# EasyEDA Pro project term_work.eprj

# Schematic Schematic1
Board Name: Board1; Create Date: 2024-12-19; Page Name: P1; Project Name: term_work; Schematic Name: Schematic1; Update Date: 2024-12-19; Company: 嘉立创EDA; Page Size: A4; Version: V1.0
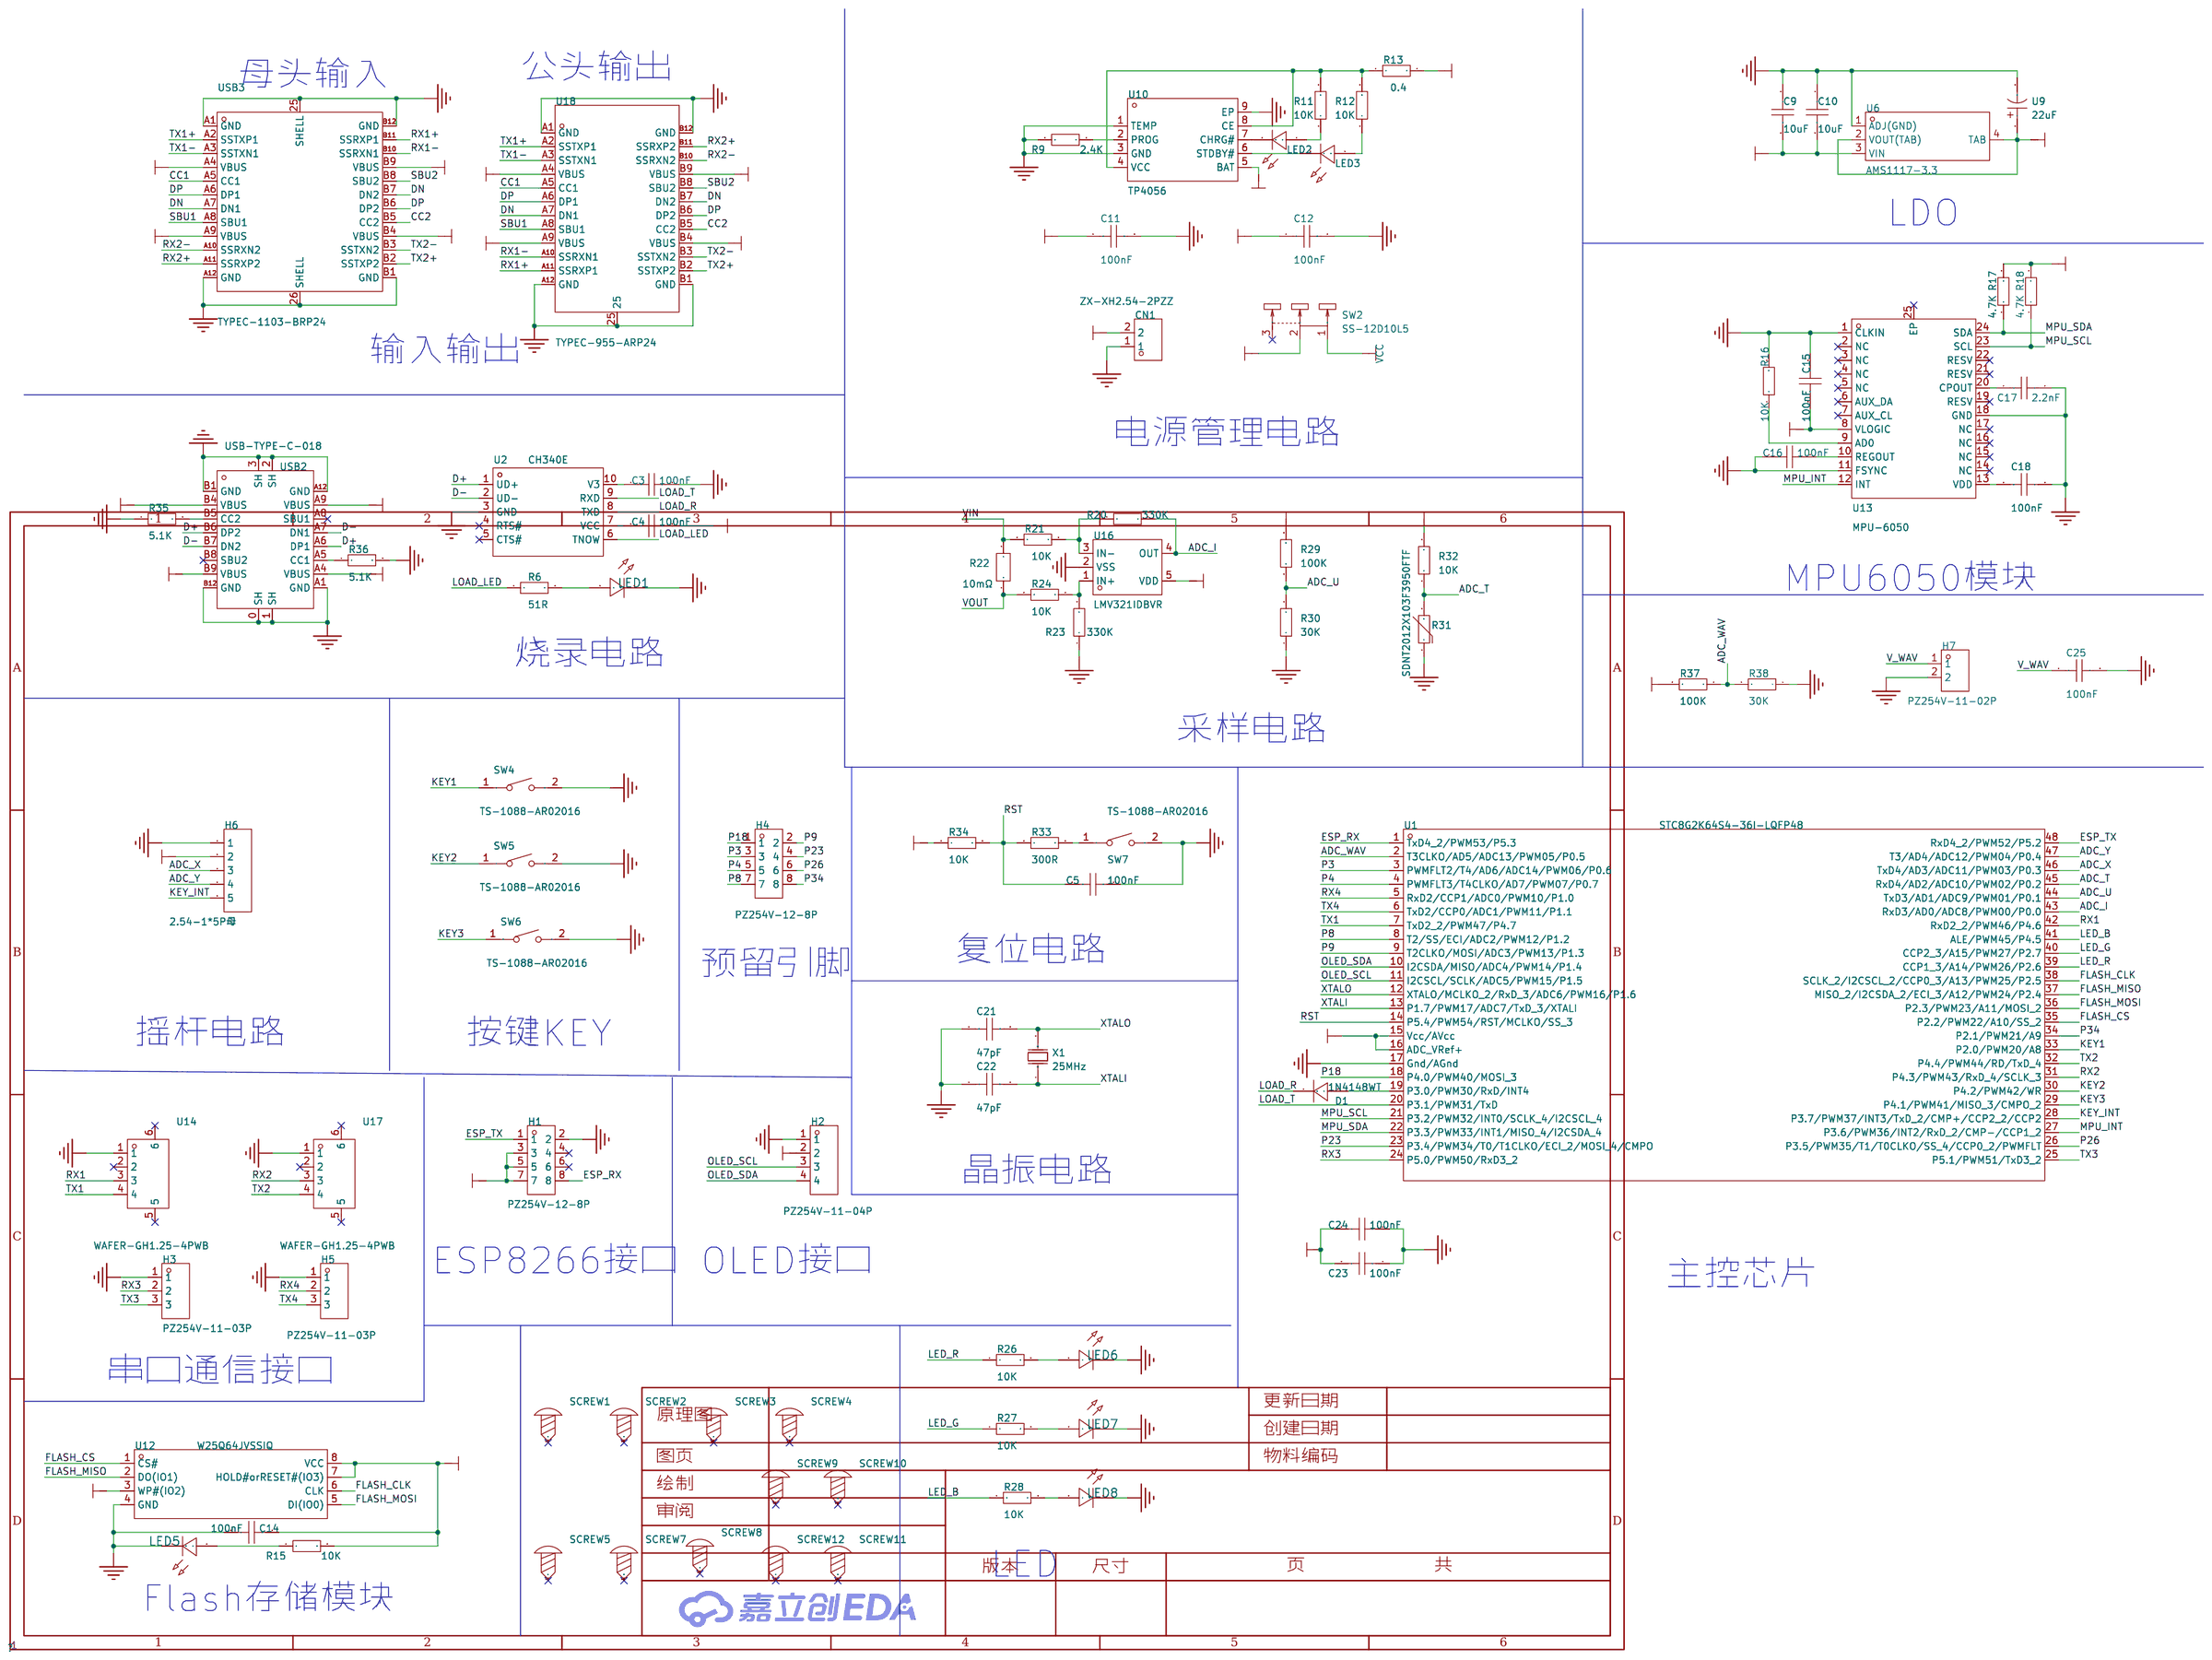
[diagram p0: schematic sheet]

## Parts
C3  100nF  [C0603]
C4  100nF  [C0603]
C5  100nF  [C0603]
C9  10uF  [C0603]
C10  10uF  [C0603]
C11  100nF  [C0603]
C12  100nF  [C0603]
C14  100nF  [C0603]
C15  100nF  [C0603]
C16  100nF  [C0603]
C17  2.2nF  [C0603]
C18  100nF  [C0603]
C21  47pF  [C0603]
C22  47pF  [C0603]
C23  100nF  [C0603]
C24  100nF  [C0603]
C25  100nF  [C0603]
CN1  ZX-XH2.54-2PZZ  [CONN-TH_2P-P2.50_HX25003-2A]
D1  1N4148WT  [SOD-523_L1.2-W0.8-LS1.6-RD]
H1  PZ254V-12-8P  [HDR-TH_8P-P2.54-V-M-R2-C4-S2.54]
H2  PZ254V-11-04P  [HDR-TH_4P-P2.54-V-M]
H3  PZ254V-11-03P  [HDR-TH_3P-P2.54-V-M]
H4  PZ254V-12-8P  [HDR-TH_8P-P2.54-V-M-R2-C4-S2.54]
H5  PZ254V-11-03P  [HDR-TH_3P-P2.54-V-M]
H6  2.54-1*5P母  [HDR-TH_5P-P2.54-V-F]
H7  PZ254V-11-02P  [HDR-TH_2P-P2.54-V-M]
LED1  -  [LED_0603]
LED2  -  [LED_TH-3mm]
LED3  -  [LED_TH-3mm]
LED5  -  [LED_0603]
LED6  -  [LED_0603]
LED7  -  [LED_0603]
LED8  -  [LED_0603]
R6  51R  [R0603]
R9  2.4K  [R0603]
R11  10K  [R0603]
R12  10K  [R0603]
R13  0.4  [R0603]
R15  10K  [R0603]
R16  10K  [R0603]
R17  4.7K  [R0603]
R18  4.7K  [R0603]
R20  330K  [R0603]
R21  10K  [R0603]
R22  10mΩ  [RES-SMD_L6.4-W3.2-1]
R23  330K  [R0603]
R24  10K  [R0603]
R26  10K  [R0603]
R27  10K  [R0603]
R28  10K  [R0603]
R29  100K  [R0603]
R30  30K  [R0603]
R31  SDNT2012X103F3950FTF  [R0805]
R32  10K  [R0603]
R33  300R  [R0603]
R34  10K  [R0603]
R35  5.1K  [R0603]
R36  5.1K  [R0603]
R37  100K  [R0603]
R38  30K  [R0603]
SCREW1  -  [M2螺丝]
SCREW2  -  [M2螺丝]
SCREW3  -  [M2螺丝]
SCREW4  -  [M2螺丝]
SCREW5  -  [M2螺丝]
SCREW7  -  [M2螺丝]
SCREW8  -  [M2螺丝]
SCREW9  -  [M3螺丝]
SCREW10  -  [M3螺丝]
SCREW11  -  [M3螺丝]
SCREW12  -  [M3螺丝]
SW2  SS-12D10L5  [SW-TH_SS-12D10L5]
SW4  TS-1088-AR02016  [SW-SMD_L3.9-W3.0-P4.45]
SW5  TS-1088-AR02016  [SW-SMD_L3.9-W3.0-P4.45]
SW6  TS-1088-AR02016  [SW-SMD_L3.9-W3.0-P4.45]
SW7  TS-1088-AR02016  [SW-SMD_L3.9-W3.0-P4.45]
U1  STC8G2K64S4-36I-LQFP48  [LQFP-48_L7.0-W7.0-P0.50-LS9.0-BL]
U2  CH340E  [MSOP-10_L3.0-W3.0-P0.50-LS5.0-BL]
U6  AMS1117-3.3  [SOT-223-4_L6.5-W3.5-P2.30-LS7.0-BR]
U9  22uF  [CAP-SMD_L2.0-W1.3-FD]
U10  TP4056  [ESOP-8_L4.9-W3.9-P1.27-LS6.0-BL-EP]
U12  W25Q64JVSSIQ  [SOIC-8_L5.3-W5.3-P1.27-LS8.0-BL]
U13  MPU-6050  [QFN-24_L4.0-W4.0-P0.50-BL-EP2.7]
U14  WAFER-GH1.25-4PWB  [CONN-SMD_4P-P1.25_XUNPU_WAFER-GH1.25-4PWB]
U16  LMV321IDBVR  [SOT-23-5_L2.9-W1.6-P0.95-LS2.8-BR]
U17  WAFER-GH1.25-4PWB  [CONN-SMD_4P-P1.25_XUNPU_WAFER-GH1.25-4PWB]
U18  TYPEC-955-ARP24  [TYPE-C-SMD_TYPEC-955-ARP24]
USB2  USB-TYPE-C-018  [USB-C_SMD-TYPE-C-31-M-12]
USB3  TYPEC-1103-BRP24  [USB-C-SMD_TYPEC-1103-BRP24]
X1  25MHz  [CRYSTAL-SMD_2P-L5.0-W3.2]

## Library data of the parts
C3-C5 C9-C12 C14-C18 C21-C25 = CAP_0603: Supplier Footprint: 0603
CN1 = ZX-XH2.54-2PZZ: 插针结构:1x2P;间距:2.54mm;安装方式:直插;参考系列:XH;总PIN数:2P;排数:1;每排PIN数:2;行距:-;额定电流:3A;触头材质:黄铜;触头镀层:锡;工作温度范围:-25℃~+85℃;; Supplier Part: C7429632; Manufacturer: Megastar(兆星); Supplier Footprint: 插件,P=2.54mm; JLCPCB Part Class: 扩展库; Datasheet: https://atta.szlcsc.com/upload/public/pdf/source/20230619/19BA6947230AA44A04D3EDD65E618FD0.pdf; Supplier: LCSC; Pins Structure: 1x2P; Pitch: 2.54mm; Mounting Style: 直插; Reference Series: XH; Number of Pins: 2P; Number of Rows: 1; Number of PINs Per Row: 2; Current Rating (Max): 3A; Contact Material: 黄铜; Contact Plating: 锡; Operating Temperature Range: -25℃~+85℃
D1 = 1N4148WT_C232841: 二极管配置:独立式;正向压降(Vf):1V@10mA;直流反向耐压(Vr):75V;平均整流电流(Io):300mA;功率:200mW;反向恢复时间(trr):4ns;; LCSC Part Name: 电压:75V 电流:300mA; Supplier Part: C232841; Manufacturer: onsemi(安森美); Supplier Footprint: SOD-523F; JLCPCB Part Class: 扩展库; Datasheet: https://atta.szlcsc.com/upload/public/pdf/source/20181222/C232841_42C5BA49E5A441BB8F6B91D0F4CD0D51.pdf; Supplier: LCSC; Diode Configuration: 独立式; Forward Voltage (Vf@If): 1V@10mA; Reverse Voltage (Vr): 75V; Average Rectified Current (Io): 300mA; Power Dissipation: 200mW; Reverse Leakage Current: 5uA@75V; Reverse Recovery Time (trr): 4ns; Operating Temperature: -55℃~+150℃@(Tj)
H1 H4 = PZ254V-12-8P: 插针结构:2x4P;间距:2.54mm;行距:2.54mm;圆针/方针:方针;安装类型:直插;排数:双排;总PIN位数:8P;额定电流:-;额定电压:-;配合针长度:6mm;塑高:2.5mm;端接针长度:3mm;触头材质:黄铜;触头镀层:-;工作温度范围:-40℃~+105℃;颜色:黑色;; LCSC Part Name: 间距:2.54mm 2x4P 直插 方针; Supplier Part: C492421; Manufacturer: XFCN(兴飞); Supplier Footprint: 插件,P=2.54mm; JLCPCB Part Class: 扩展库; Datasheet: https://atta.szlcsc.com/upload/public/pdf/source/20200309/C492421_DC8A206AF99CD7755BD4A5B0BC48200B.pdf; Supplier: LCSC; Pin Structure: 2x4P; Pitch: 2.54mm; Row Spacing: 2.54mm; Circluar Pins/Square Pins: 方针; Mounting Type: 直插; Number of Rows: 双排; Number of Pins: 8P; Length of Mating Pin: 6mm; Insulation Height: 2.5mm; Length of End Connection Pin: 3mm; Contact Material: 黄铜; Operating Temperature Range: -40℃~+105℃; Color: 黑色
H2 = PZ254V-11-04P: 插针结构:1x4P;间距:2.54mm;行距:-;圆针/方针:方针;安装类型:直插;排数:单排;总PIN位数:4P;额定电流:3A;额定电压:250V;配合针长度:6mm;塑高:2.5mm;端接针长度:3mm;触头材质:-;工作温度范围:-40℃~+105℃;颜色:黑色;; LCSC Part Name: 间距:2.54mm 1x4P 直插 方针; Supplier Part: C2691448; Manufacturer: XFCN(兴飞); Supplier Footprint: 插件,P=2.54mm; JLCPCB Part Class: 扩展库; Datasheet: https://atta.szlcsc.com/upload/public/pdf/source/20200309/C492403_F9F19131791D08044AD4F84F8E751A34.pdf; Supplier: LCSC; Pin Structure: 1x4P; Pitch: 2.54mm; Circluar Pins/Square Pins: 方针; Mounting Type: 直插; Number of Rows: 单排; Number of Pins: 4P; Current Rating (Max): 3A; Voltage Rating (Max): 250V; Length of Mating Pin: 6mm; Insulation Height: 2.5mm; Length of End Connection Pin: 3mm; Operating Temperature Range: -40℃~+105℃; Color: 黑色
H3 H5 = PZ254V-11-03P: 插针结构:1x3P;间距:2.54mm;行距:-;圆针/方针:方针;安装类型:直插;排数:单排;总PIN位数:3P;额定电流:3A;额定电压:250V;配合针长度:6mm;塑高:2.5mm;端接针长度:3mm;工作温度范围:-40℃~+105℃;颜色:黑色;; LCSC Part Name: 间距:2.54mm 1x3P 直插 方针; Supplier Part: C2937625; Manufacturer: XFCN(兴飞); Supplier Footprint: 插件,P=2.54mm; JLCPCB Part Class: 扩展库; Datasheet: https://atta.szlcsc.com/upload/public/pdf/source/20200309/C492402_8335C3D49C4E4C618838D59BB1D024C1.pdf; Supplier: LCSC; Pin Structure: 1x3P; Pitch: 2.54mm; Circluar Pins/Square Pins: 方针; Mounting Type: 直插; Number of Rows: 单排; Number of Pins: 3P; Current Rating (Max): 3A; Voltage Rating (Max): 250V; Length of Mating Pin: 6mm; Insulation Height: 2.5mm; Length of End Connection Pin: 3mm; Operating Temperature Range: -40℃~+105℃; Color: 黑色
H6 = 2.54-1*5P母: 插孔结构:1x5P;间距:2.54mm;行距:-;安装类型:直插;排数:单排;总孔位数:5P;塑高:-;触头材质:-;触头镀层:-;; LCSC Part Name: 间距:2.54mm 1x5P 直插; Supplier Part: C50950; Manufacturer: BOOMELE(博穆精密); Supplier Footprint: 插件,P=2.54mm; JLCPCB Part Class: 扩展库; Datasheet: https://atta.szlcsc.com/upload/public/pdf/source/20210301/C2718488_F4427B881E42CAA8DDB0B1C12B3A522C.pdf; Supplier: LCSC; Holes Structure: 1x5P; Pitch: 2.54mm; Mounting Type: 直插; Number of Rows: 单排; Number of Holes: 5P
H7 = PZ254V-11-02P: 插针结构:1x2P;间距:2.54mm;行距:-;圆针/方针:方针;安装类型:直插;排数:单排;总PIN位数:2P;额定电流:-;额定电压:-;配合针长度:6mm;塑高:2.5mm;端接针长度:3mm;触头材质:黄铜;触头镀层:-;工作温度范围:-40℃~+105℃;颜色:黑色;; LCSC Part Name: 间距:2.54mm 1x2P 直插 方针; Supplier Part: C492401; Manufacturer: XFCN(兴飞); Supplier Footprint: 插件,P=2.54mm; JLCPCB Part Class: 扩展库; Datasheet: https://atta.szlcsc.com/upload/public/pdf/source/20200309/C492401_A812433581A9B211A7FFA413ADDFF0E5.pdf; Supplier: LCSC; Pin Structure: 1x2P; Pitch: 2.54mm; Circluar Pins/Square Pins: 方针; Mounting Type: 直插; Number of Rows: 单排; Number of Pins: 2P; Length of Mating Pin: 6mm; Insulation Height: 2.5mm; Length of End Connection Pin: 3mm; Contact Material: 黄铜; Operating Temperature Range: -40℃~+105℃; Color: 黑色
LED1 LED5-LED8 = LED_0603-R: Supplier Footprint: 0603
LED2 LED3 = LED_TH-R_3mm: Supplier Footprint: 插件
R6 R9 R11-R13 R15-R18 R20 R21 R23 R24 R26-R30 R32-R38 = Res_0603: Supplier Footprint: 0603
R22 = HoJLR2512-3W-5mR-1%: 电阻类型:采样电阻;阻值:5mΩ;精度:±1%;功率:3W;安装方式:贴片;; LCSC Part Name: 5mΩ ±1% 3W; Supplier Part: C2903482; Manufacturer: Milliohm(毫欧); Supplier Footprint: 2512; JLCPCB Part Class: 扩展库; Datasheet: https://atta.szlcsc.com/upload/public/pdf/source/20211009/7525CABAB363C979E942C1DD41F1FEF0.pdf; Supplier: LCSC; Type: 采样电阻; Tolerance: ±1%; Power(Watts): 3W; Mounting Sytle: 贴片
R31 = SDNT2012X103F3950FTF: 阻值(25℃):10kΩ;B值(25℃/50℃):3950K;电阻精度:±1%;功率:200mW;B值精度:±1%;最大稳态电流(25℃):440uA;; LCSC Part Name: 10kΩ 电阻精度:±1% 3950K; Supplier Part: C95968; Manufacturer: Sunlord(顺络); Supplier Footprint: 0805; JLCPCB Part Class: 扩展库; Datasheet: https://atta.szlcsc.com/upload/public/pdf/source/20210916/BF106A3565EDFEB141CB3E0EA3A661F8.pdf; Supplier: LCSC; Resistance @ 25℃: 10kΩ; B Constant (25℃/50℃): 3950K; Resistance Tolerance: ±1%; Power: 200mW; B Constant Tolerance: ±1%; Steady State Current (Max): 440uA; Operating Temperature: -55℃~+125℃
SCREW1-SCREW5 SCREW7 SCREW8 = M2螺丝: Supplier Footprint: 插件
SCREW9-SCREW12 = M3螺丝: Supplier Footprint: 插件
SW2 = SS-12D10L5: 电路结构:单刀双掷;安装方式:直插;开关颜色:黑色;额定电流(DC):3A;额定电压(DC):125V;额定电流(AC):3A;额定电压(AC):125V;机械寿命:1万次;; LCSC Part Name: 柄长5mm 直插双档 滑动开关; Supplier Part: C319012; Manufacturer: XKB Connectivity(中国星坤); Supplier Footprint: 插件; JLCPCB Part Class: 扩展库; Datasheet: https://atta.szlcsc.com/upload/public/pdf/source/20211009/D6412F37AABE6F9459A6EE7FA4DAEADB.pdf; Supplier: LCSC; Circuit: 单刀双掷; Actuator Style: 矩形柱状; Pin Style: PC引脚; Switch Length: 13mm; Switch Width: 6.8mm; Switch Height: 6.4mm; Mounting Style: 直插; Actuator Color: 黑色; Current Rating (DC): 3A; Voltage Rating (DC): 125V; Current Rating (AC): 3A; Voltage Rating (AC): 125V; Mechanical Life: 1万次; Operating Temperature: -40℃~+85℃
SW4-SW7 = TS-1088-AR02016: 电路结构:单刀单掷;按钮形状:圆形按钮;作用力:160gf;安装方式:立贴;开关长度:4mm;开关宽度:3mm;开关高度:2mm;带支架:不带;触点电流:50mA;额定电压(DC):12V;绝缘电阻:100MΩ;机械寿命:10万次;; LCSC Part Name: 4*3*2mm 立贴 轻触开关; Supplier Part: C720477; Manufacturer: XUNPU(讯普); Supplier Footprint: SMD; JLCPCB Part Class: 扩展库; Datasheet: https://atta.szlcsc.com/upload/public/pdf/source/20200810/C720475_60D09DD6C54279ADDB2DC25100F1CC11.pdf; Supplier: LCSC; Circuit: 单刀单掷; Actuator Style: 圆形按钮; Operating Force: 160gf; Mounting Style: 立贴; Switch Length: 4mm; Switch Width: 3mm; Switch Height: 2mm; Strike Gundam: 不带; Contact Current: 50mA; Voltage Rating (DC): 12V; Insulation Resistance: 100MΩ; Actuator/Cap Color: 黑色; Pin Style: SMD接片; Mechanical Life: 10万次; Operating Temperature: -30℃~+80℃
U1 = STC8G2K64S4-36I-LQFP48: CPU内核:51系列;程序存储容量:64KB;RAM总容量:2.25KB;GPIO端口数量:45;工作电压范围:1.9V~5.5V;CPU最大主频:-;程序存储器类型:FLASH;; Supplier Part: C915668; Manufacturer: STC(宏晶); Supplier Footprint: LQFP-48(7x7); JLCPCB Part Class: 扩展库; Datasheet: https://atta.szlcsc.com/upload/public/pdf/source/20230914/7707908C45C6343AE73767C1466DDB8D.pdf; Supplier: LCSC; CPU Core: 51系列; Program Storage Size: 64KB; RAM Size: 2.25KB; GPIO Ports Number: 45; Operating Voltage Range: 1.9V~5.5V; Program Memory Type: FLASH; Operating Temperature Range: -40℃~+85℃; ADC (Bit): 10bit; PWM (Bit): 15bit; 16Bit Timer: 5; UART/USART: 4; I2C: 1; SPI: 1; Internal Comparator: 有; Peripheral/Function: 低电压检测；看门狗；CCP捕获/比较；除法器；乘法器; Watchdog: 有; Low-Voltage Detect: 有; CCP Capture/Compare: 有; Internal Oscillator: 有
U2 = CH340E: 应用功能:收发器;接口协议:USB 2.0;数据速率:2Mbps;; LCSC Part Name: USB转串口芯片 CH340; Supplier Part: C99652; Manufacturer: WCH(南京沁恒); Supplier Footprint: MSOP-10; JLCPCB Part Class: 扩展库; Datasheet: https://atta.szlcsc.com/upload/public/pdf/source/20230530/6E401E9554E9F5311886CC8B3F89B62E.pdf; Supplier: LCSC; Applications Function: 收发器; Protocol: USB 2.0; Supply Voltage: 3.3V；5V; Data Rate: 2Mbps
U6 = AMS1117-3.3_C347222: 输出类型:固定;最大输入电压:18V;输出电压:3.3V;输出电流:1A;电源纹波抑制比(PSRR):60dB@(120Hz);输出极性:正极;; LCSC Part Name: 输出:3.3V 电流:1A 耐压:12V; Supplier Part: C347222; Manufacturer: UMW(友台半导体); Supplier Footprint: SOT-223; JLCPCB Part Class: 扩展库; Datasheet: https://atta.szlcsc.com/upload/public/pdf/source/20231109/155D79A26D9DB04352555A58D5969DC8.pdf; Supplier: LCSC; Output Type: 固定; Maximum Input Voltage: 18V; Output Voltage: 3.3V; Output Current: 1A; Power Supply Rejection Ratio (PSRR): 60dB@(120Hz); Dropout Voltage: 1.3V@(1A); Feature: 过流保护(OCP); Output Polarity: 正极; Number of Outputs: 1
U9 = TMCP0J226MTRF: 容值:22uF;精度:±20%;额定电压:6.3V;等效串联电阻:5.9Ω@100kHz;; LCSC Part Name: 22uF ±20% 6.3V; Supplier Part: C4983891; Manufacturer: VISHAY(威世); Supplier Footprint: 0805; JLCPCB Part Class: 扩展库; Datasheet: https://atta.szlcsc.com/upload/public/pdf/source/20231213/45DEC9D623A3BCD604D80B89FE3D1B4C.pdf; Supplier: LCSC; Tolerance: ±20%; Rated Voltage: 6.3V; Equivalent Series Resistance(ESR): 5.9Ω@100kHz; Operating Temperature: -55℃~+125℃
U10 = TP4056_C725790: Supplier Part: C725790; Manufacturer: UMW(友台半导体); Supplier Footprint: ESOP-8; JLCPCB Part Class: Extended Part; Datasheet: https://atta.szlcsc.com/upload/public/pdf/source/20211011/37515E71BA298E23D23475482C49633D.pdf; Supplier: LCSC
U12 = W25Q64JVSSIQ: Supplier Part: C179171; Manufacturer: WINBOND(华邦); Supplier Footprint: SOIC-8-208mil; JLCPCB Part Class: 扩展库; Datasheet: https://atta.szlcsc.com/upload/public/pdf/source/20191218/C179171_92C5C91D0324539EDD8F1160D2E79C0F.pdf; Supplier: LCSC
U13 = MPU-6050: 传感器类型:加速度计陀螺仪;; Supplier Part: C24112; Manufacturer: TDK InvenSense(应美盛); Supplier Footprint: QFN-24-EP(4x4); JLCPCB Part Class: 扩展库; Datasheet: https://atta.szlcsc.com/upload/public/pdf/source/20140425/1457707046159.pdf; Supplier: LCSC; Sensor Type: 加速度计陀螺仪; Operating Temperature: -40℃~+85℃
U14 U17 = WAFER-GH1.25-4PWB: 插针结构:1x4P;间距:1.25mm;安装方式:卧贴;参考系列:GH;总PIN数:4P;排数:1;每排PIN数:4;额定电流:1A;工作温度范围:-25℃~+85℃;; LCSC Part Name: 1x4P 间距:1.25mm 卧贴 系列:GH; Supplier Part: C3029379; Manufacturer: XUNPU(讯普); Supplier Footprint: SMD,P=1.25mm,卧贴; JLCPCB Part Class: 扩展库; Datasheet: https://atta.szlcsc.com/upload/public/pdf/source/20220527/CB8773BFB0913C3B8ABD62CB38BA101A.pdf; Supplier: LCSC; Pins Structure: 1x4P; Pitch: 1.25mm; Mounting Style: 卧贴; Reference Series: GH; Number of Pins: 4P; Number of Rows: 1; Number of PINs Per Row: 4; Current Rating (Max): 1A; Operating Temperature Range: -25℃~+85℃
U16 = LMV321IDBVR_C3014306: 低功耗运放; Supplier Part: C3014306; Manufacturer: UMW(友台半导体); Supplier Footprint: SOT-23-5; JLCPCB Part Class: 扩展库; Datasheet: https://atta.szlcsc.com/upload/public/pdf/source/20231221/3CE86AED7262DC01AD69B40B1A503791.pdf; Supplier: LCSC
U18 = TYPEC-955-ARP24: 连接器类型:Type-C;标准:USB 3.1;公母:公;端口数量:1;触点数量:24P;安装方式:夹板;额定电流 - 电源:3A;触头材质:-;触头镀层:-;工作温度范围:-25℃~+85℃;焊接温度(最大值):260℃;; LCSC Part Name: Type-C 公 夹板; Supplier Part: C2895018; Manufacturer: XUNPU(讯普); Supplier Footprint: SMD; JLCPCB Part Class: 扩展库; Datasheet: https://atta.szlcsc.com/upload/public/pdf/source/20210908/4BE163E2B5C3395EA3793A403F88C638.pdf; Supplier: LCSC; Connector Type: Type-C; Standard: USB 3.1; Gender: 公; Number of Ports: 1; Number of Contacts: 24P; Mounting Style: 夹板; Current Rating - Power (Max): 3A; Operating Temperature Range: -25℃~+85℃; Soldering Temperature(Max): 260℃
USB2 = USB-TYPE-C-018: 连接器类型:Type-C;标准:-;公母:母;安装方式:卧贴;触点数量:16P;端口数量:1;额定电流 - 电源:3A;工作温度范围:-25℃~+85℃;; LCSC Part Name: Type-C 母 卧贴; Supplier Part: C2927038; Manufacturer: DEALON(德艺隆); Supplier Footprint: SMD; JLCPCB Part Class: 扩展库; Datasheet: https://atta.szlcsc.com/upload/public/pdf/source/20211217/CCD3D517E355E8E0CC52ABD8D5784AD8.pdf; Supplier: LCSC; Connector Type: Type-C; Gender: 母; Mounting Style: 卧贴; Number of Contacts: 16P; Number of Ports: 1; Current Rating - Power (Max): 3A; Operating Temperature Range: -25℃~+85℃
USB3 = TYPEC-1103-BRP24: 连接器类型:Type-C;标准:USB 3.1;公母:母;安装方式:夹板;触点数量:24P;端口数量:1;额定电流 - 电源:5A;工作温度范围:-30℃~+85℃;焊接温度(最大值):260℃;; LCSC Part Name: Type-C 母 夹板; Supplier Part: C2856665; Manufacturer: XUNPU(讯普); Supplier Footprint: SMD; JLCPCB Part Class: 扩展库; Datasheet: https://atta.szlcsc.com/upload/public/pdf/source/20220916/9C8CB477EC6775E046E4DED126C7C51B.pdf; Supplier: LCSC; Connector Type: Type-C; Standard: USB 3.1; Gender: 母; Mounting Style: 夹板; Number of Contacts: 24P; Number of Ports: 1; Current Rating - Power (Max): 5A; Operating Temperature Range: -30℃~+85℃; Soldering Temperature(Max): 260℃
X1 = XG1EL89CSI-111YLC-25M: 晶振类型:贴片晶振;频率:25MHz;常温频差:±10ppm;外接负载电容:20pF;频率稳定度(全温):±20ppm;; LCSC Part Name: 25MHz ±10ppm 20pF; Supplier Part: C7471626; Manufacturer: YXC(扬兴晶振); Supplier Footprint: SMD5032; JLCPCB Part Class: 扩展库; Datasheet: https://atta.szlcsc.com/upload/public/pdf/source/20240329/44922B0AF7B60E58E9B66993B6077277.pdf; Supplier: LCSC; Crystal Type: 贴片晶振; Normal temperature Frequency Tolerance: ±10ppm; External load capacitor: 20pF; Frequency Stability(Full temperature range): ±20ppm; Operating Temperature: -40℃~+85℃

## Nets
3V3: C14.2 C15.1 C23.2 C24.2 H1.3 H1.5 H1.7 H2.2 H6.2 R15.2 R17.2 R18.2 R32.2 R34.1 U1.15(Vcc/AVcc) U1.16(ADC_VRef+) U6.2(VOUT(TAB)) U6.4(TAB) U9.1 U12.3(WP#(IO2)) U12.7(HOLD#orRESET#(IO3)) U12.8(VCC) U13.8(VLOGIC) U16.5(VDD)
GND: C3.2 C5.1 C9.1 C10.1 C11.2 C12.2 C14.1 C15.2 C16.1 C17.2 C18.2 C21.1 C22.1 C23.1 C24.1 C25.2 CN1.1 H1.2 H2.1 H3.1 H5.1 H6.1 H7.2 LED1.1(C) LED5.1(C) LED6.1(C) LED7.1(C) LED8.1(C) R9.1 R16.2 R23.1 R30.1 R31.1 R35.1 R36.2 R38.1 SW4.2 SW5.2 SW6.2 SW7.2 U1.17(Gnd/AGnd) U2.3(GND) U6.1(ADJ(GND)) U9.2 U10.1(TEMP) U10.3(GND) U10.9(EP) U12.4(GND) U13.1(CLKIN) U13.11(FSYNC) U13.18(GND) U14.1 U16.2(VSS) U17.1 U18.25 U18.A1(GND) U18.A12(GND) U18.B1(GND) U18.B12(GND) USB2.0(SH) USB2.1(SH) USB2.2(SH) USB2.3(SH) USB2.A1(GND) USB2.A12(GND) USB2.B1(GND) USB2.B12(GND) USB3.25(SHELL) USB3.26(SHELL) USB3.A1(GND) USB3.A12(GND) USB3.B1(GND) USB3.B12(GND)
VBUS: C4.1 C11.1 R13.2 USB2.A4(VBUS) USB2.A9(VBUS) USB2.B4(VBUS) USB2.B9(VBUS)
VCC: C9.2 C10.2 SW2.1 U6.3(VIN)
VIN: R21.2 R22.2 R29.2 USB3.A4(VBUS) USB3.A9(VBUS) USB3.B4(VBUS) USB3.B9(VBUS)
ADC_I: R20.1 U1.43(RxD3/AD0/ADC8/PWM00/P0.0) U16.4(OUT)
ADC_T: R31.2 R32.1 U1.45(RxD4/AD2/ADC10/PWM02/P0.2)
ADC_U: R29.1 R30.2 U1.44(TxD3/AD1/ADC9/PWM01/P0.1)
ADC_WAV: R37.1 R38.2 U1.2(T3CLKO/AD5/ADC13/PWM05/P0.5)
ADC_X: H6.3 U1.46(TxD4/AD3/ADC11/PWM03/P0.3)
ADC_Y: H6.4 U1.47(T3/AD4/ADC12/PWM04/P0.4)
BAT: C12.1 CN1.2 SW2.2 U10.5(BAT)
CC1: U18.A5(CC1) USB3.A5(CC1)
CC2: U18.B5(CC2) USB3.B5(CC2)
D+: U2.1(UD+) USB2.A6(DP1) USB2.B6(DP2)
D-: U2.2(UD-) USB2.A7(DN1) USB2.B7(DN2)
DN: U18.A7(DN1) U18.B7(DN2) USB3.A7(DN1) USB3.B7(DN2)
DP: U18.A6(DP1) U18.B6(DP2) USB3.A6(DP1) USB3.B6(DP2)
ESP_RX: H1.8 U1.1(TxD4_2/PWM53/P5.3)
ESP_TX: H1.1 U1.48(RxD4_2/PWM52/P5.2)
FLASH_CLK: U1.38(SCLK_2/I2CSCL_2/CCP0_3/A13/PWM25/P2.5) U12.6(CLK)
FLASH_CS: U1.35(P2.2/PWM22/A10/SS_2) U12.1(CS#)
FLASH_MISO: U1.37(MISO_2/I2CSDA_2/ECI_3/A12/PWM24/P2.4) U12.2(DO(IO1))
FLASH_MOSI: U1.36(P2.3/PWM23/A11/MOSI_2) U12.5(DI(IO0))
KEY1: SW4.1 U1.33(P2.0/PWM20/A8)
KEY2: SW5.1 U1.30(P4.2/PWM42/WR)
KEY3: SW6.1 U1.29(P4.1/PWM41/MISO_3/CMPO_2)
KEY_INT: H6.5 U1.28(P3.7/PWM37/INT3/TxD_2/CMP+/CCP2_2/CCP2)
LED_B: R28.1 U1.41(ALE/PWM45/P4.5)
LED_G: R27.1 U1.40(CCP2_3/A15/PWM27/P2.7)
LED_R: R26.1 U1.39(CCP1_3/A14/PWM26/P2.6)
LOAD_LED: R6.1 U2.6(TNOW)
LOAD_R: D1.1(C) U2.8(TXD)
LOAD_T: U1.20(P3.1/PWM31/TxD) U2.9(RXD)
MPU_INT: U1.27(P3.6/PWM36/INT2/RxD_2/CMP-/CCP1_2) U13.12(INT)
MPU_SCL: R18.1 U1.21(P3.2/PWM32/INT0/SCLK_4/I2CSCL_4) U13.23(SCL)
MPU_SDA: R17.1 U1.22(P3.3/PWM33/INT1/MISO_4/I2CSDA_4) U13.24(SDA)
OLED_SCL: H2.3 U1.11(I2CSCL/SCLK/ADC5/PWM15/P1.5)
OLED_SDA: H2.4 U1.10(I2CSDA/MISO/ADC4/PWM14/P1.4)
P3: H4.3 U1.3(PWMFLT2/T4/AD6/ADC14/PWM06/P0.6)
P4: H4.5 U1.4(PWMFLT3/T4CLKO/AD7/PWM07/P0.7)
P8: H4.7 U1.8(T2/SS/ECI/ADC2/PWM12/P1.2)
P9: H4.2 U1.9(T2CLKO/MOSI/ADC3/PWM13/P1.3)
P18: H4.1 U1.18(P4.0/PWM40/MOSI_3)
P23: H4.4 U1.23(P3.4/PWM34/T0/T1CLKO/ECI_2/MOSI_4/CMPO)
P26: H4.6 U1.26(P3.5/PWM35/T1/T0CLKO/SS_4/CCP0_2/PWMFLT)
P34: H4.8 U1.34(P2.1/PWM21/A9)
RST: C5.2 R33.1 R34.2 U1.14(P5.4/PWM54/RST/MCLKO/SS_3)
RX1: U1.42(RxD2_2/PWM46/P4.6) U14.3
RX1+: U18.A11(SSRXP1) USB3.B11(SSRXP1)
RX1-: U18.A10(SSRXN1) USB3.B10(SSRXN1)
RX2: U1.31(P4.3/PWM43/RxD_4/SCLK_3) U17.3
RX2+: U18.B11(SSRXP2) USB3.A11(SSRXP2)
RX2-: U18.B10(SSRXN2) USB3.A10(SSRXN2)
RX3: H3.2 U1.24(P5.0/PWM50/RxD3_2)
RX4: H5.2 U1.5(RxD2/CCP1/ADC0/PWM10/P1.0)
SBU1: U18.A8(SBU1) USB3.A8(SBU1)
SBU2: U18.B8(SBU2) USB3.B8(SBU2)
TX1: U1.7(TxD2_2/PWM47/P4.7) U14.4
TX1+: U18.A2(SSTXP1) USB3.A2(SSTXP1)
TX1-: U18.A3(SSTXN1) USB3.A3(SSTXN1)
TX2: U1.32(P4.4/PWM44/RD/TxD_4) U17.4
TX2+: U18.B2(SSTXP2) USB3.B2(SSTXP2)
TX2-: U18.B3(SSTXN2) USB3.B3(SSTXN2)
TX3: H3.3 U1.25(P5.1/PWM51/TxD3_2)
TX4: H5.3 U1.6(TxD2/CCP0/ADC1/PWM11/P1.1)
V_WAV: C25.1 H7.1 R37.2
VOUT: R22.1 R24.2 U18.A4(VBUS) U18.A9(VBUS) U18.B4(VBUS) U18.B9(VBUS)
XTALI: C22.2 U1.13(P1.7/PWM17/ADC7/TxD_3/XTALI) X1.1(OSC1)
XTALO: C21.2 U1.12(XTALO/MCLKO_2/RxD_3/ADC6/PWM16/P1.6) X1.2(OSC2)
$1N8906: C3.1 U2.10(V3)
$1N8907: C4.2 U2.7(VCC)
$1N8911: LED1.2(A) R6.2
$1N8927: R36.1 USB2.A5(CC1)
$1N8929: R35.2 USB2.B5(CC2)
$1N8941: LED3.2(A) U10.6(STDBY#)
$1N8942: LED2.2(A) U10.7(CHRG#)
$1N8943: LED3.1(C) R12.1
$1N8944: R9.2 U10.2(PROG)
$1N8946: R11.2 R12.2 R13.1 U10.4(VCC) U10.8(CE)
$1N8947: LED2.1(C) R11.1
$1N8963: LED5.2(A) R15.1
$1N8976: R16.1 U13.9(AD0)
$1N8980: C16.2 U13.10(REGOUT)
$1N8986: C17.1 U13.20(CPOUT)
$1N8988: C18.1 U13.13(VDD)
$1N8997: R20.2 R21.1 U16.3(IN-)
$1N9001: R23.2 R24.1 U16.1(IN+)
$1N9015: LED6.2(A) R26.2
$1N9019: LED7.2(A) R27.2
$1N9023: LED8.2(A) R28.2
$1N9160: D1.2(A) U1.19(P3.0/PWM30/RxD/INT4)
$1N9164: R33.2 SW7.1

Not connected (* = marked no-connect by the designer): H1 4* 6*; SCREW1 1*; SCREW2 1*; SCREW3 1*; SCREW4 1*; SCREW5 1*; SCREW7 1*; SCREW8 1*; SCREW9 1*; SCREW10 1*; SCREW11 1*; SCREW12 1*; SW2 3*; U2 4(RTS#)* 5(CTS#)*; U13 2(NC)* 3(NC)* 4(NC)* 5(NC)* 6(AUX_DA)* 7(AUX_CL)* 14(NC)* 15(NC)* 16(NC)* 17(NC)* 19(RESV)* 21(RESV)* 22(RESV)* 25(EP)*; U14 2* 5* 6*; U17 2* 5* 6*; USB2 A8(SBU1)* B8(SBU2)*

## Notes on the sheet
- 母头输入
- 公头输出
- LDO
- 输入输出
- 电源管理电路
- MPU6050模块
- 烧录电路
- 采样电路
- 复位电路
- 预留引脚
- 摇杆电路
- 按键KEY
- 晶振电路
- ESP8266接口
- OLED接口
- 主控芯片
- 串口通信接口
- LED
- Flash存储模块

# Board PCB1
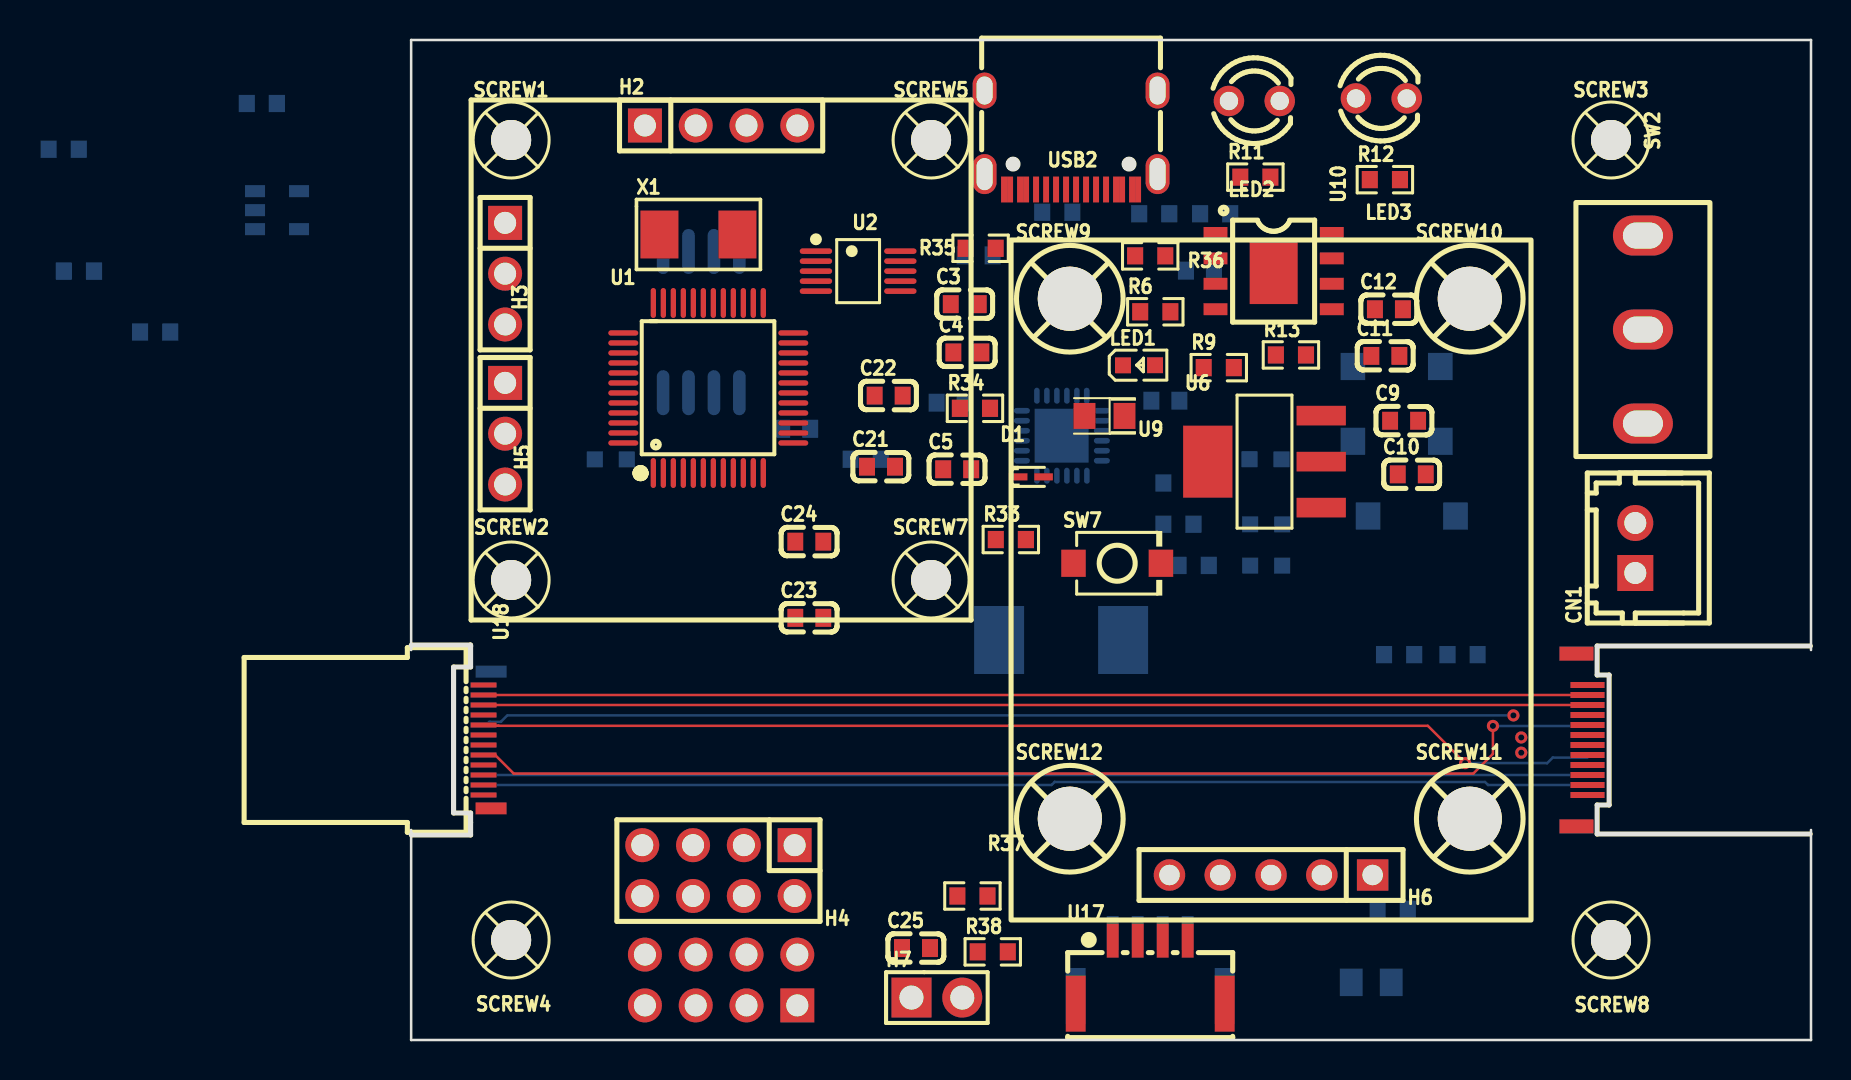
[diagram p1: board, top side]
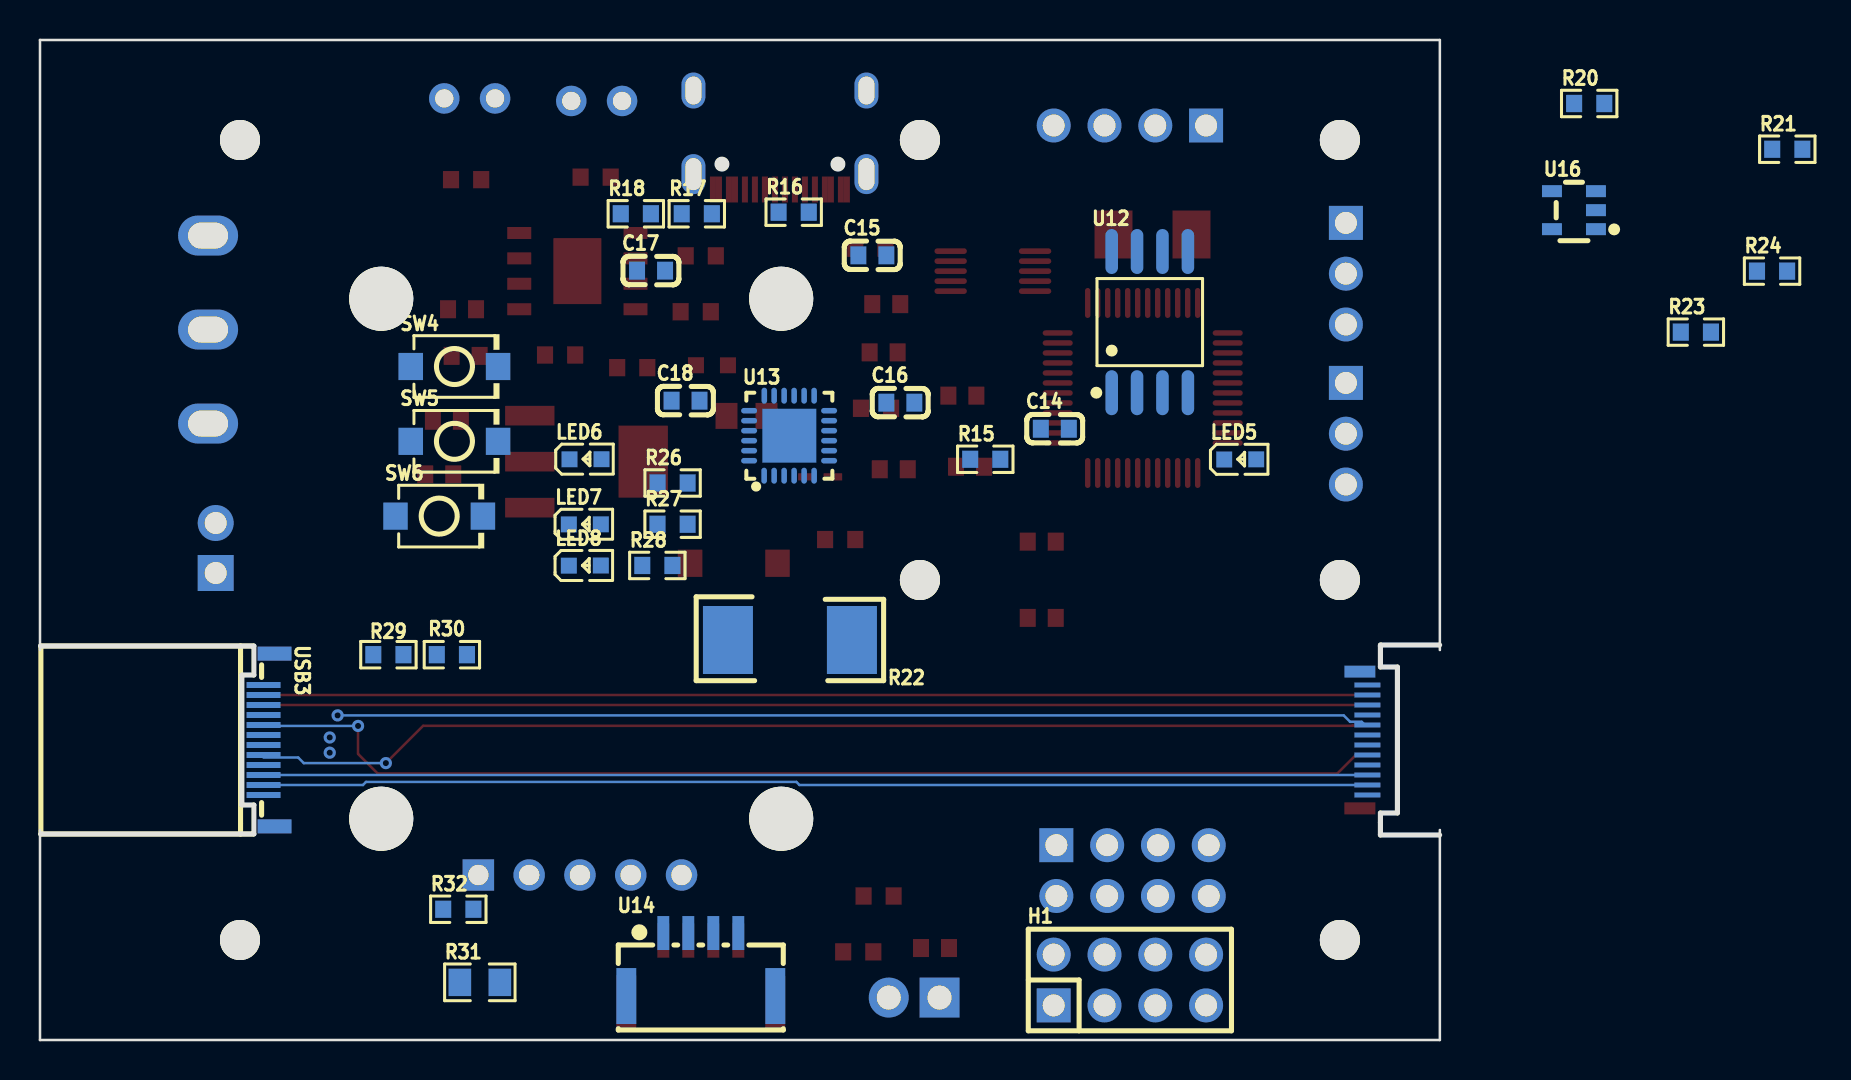
[diagram p2: board, bottom side, seen from below]

Outline 70 x 50 mm; copper layers: Top Layer, Bottom Layer. Coordinates in mm from the lower left corner of the outline.
Outline path: 0,19.5 0,50 70,50 70,19.5 ; 0,10.5 0,0 70,0 70,10.5
Stack: Top Layer 0.035mm / Dielectric1 1.51mm FR4 er 4.5 / Bottom Layer 0.035mm

## Design rules (mm)
template: JLCPCB Capability(Two Layers Board)
spacing copperThickness1oz (default): track to track 0.102, other pairs 0.152 to 0.3
spacing copperThickness2oz: track to track 0.203, other pairs 0.152 to 0.3
track width copperThickness1oz (default): min 0.127, default 0.254, max 2.54
track width copperThickness2oz: min 0.203, default 0.254, max 2.54
differential pair differentialPair (default): width min 0.127, default 0.254, max 2.54; gap min 0.152, default 0.152
via viaSize (default): diameter min 0.5, default 0.61, max 10; hole min 0.3, default 0.305, max 6.3

## Placement (name value [footprint] x y rotation side)
C3  100nF  [C0603]  27.69 36.79 0 top
C4  100nF  [C0603]  27.81 34.38 0 top
C5  100nF  [C0603]  27.31 28.54 0 top
C9  10uF  [C0603]  49.65 30.96 0 top
C10  10uF  [C0603]  50.04 28.28 0 top
C11  100nF  [C0603]  48.72 34.21 0 top
C12  100nF  [C0603]  48.9 36.54 0 top
C14  100nF  [C0603]  19.25 30.56 180 bottom
C15  100nF  [C0603]  28.37 39.23 180 bottom
C16  100nF  [C0603]  26.98 31.87 180 bottom
C17  2.2nF  [C0603]  39.44 38.47 180 bottom
C18  100nF  [C0603]  37.72 31.97 180 bottom
C21  47pF  [C0603]  23.5 28.66 0 top
C22  47pF  [C0603]  23.88 32.22 0 top
C23  100nF  [C0603]  19.91 21.11 0 top
C24  100nF  [C0603]  19.91 24.92 0 top
C25  100nF  [C0603]  25.25 4.6 0 top
CN1  ZX-XH2.54-2PZZ  [CONN-TH_2P-P2.50_HX25003-2A]  61.21 24.6 90 top
D1  1N4148WT  [SOD-523_L1.2-W0.8-LS1.6-RD]  30.99 28.16 0 top
H1  PZ254V-12-8P  [HDR-TH_8P-P2.54-V-M-R2-C4-S2.54]  15.5 3 180 bottom
H2  PZ254V-11-04P  [HDR-TH_4P-P2.54-V-M]  15.5 45.72 0 top
H3  PZ254V-11-03P  [HDR-TH_3P-P2.54-V-M]  4.7 38.32 270 top
H4  PZ254V-12-8P  [HDR-TH_8P-P2.54-V-M-R2-C4-S2.54]  15.37 8.47 180 top
H5  PZ254V-11-03P  [HDR-TH_3P-P2.54-V-M]  4.7 30.31 270 top
H6  2.54-1*5P母  [HDR-TH_5P-P2.54-V-F]  43 8.25 180 top
H7  PZ254V-11-02P  [HDR-TH_2P-P2.54-V-M]  26.29 2.12 0 top
LED1  -  [LED_0603]  36.45 33.74 0 top
LED2  -  [LED_TH-3mm]  42.16 46.95 0 top
LED3  -  [LED_TH-3mm]  48.51 47.08 0 top
LED5  -  [LED_0603]  9.93 29.04 180 bottom
LED6  -  [LED_0603]  42.67 29.05 180 bottom
LED7  -  [LED_0603]  42.71 25.79 180 bottom
LED8  -  [LED_0603]  42.71 23.73 180 bottom
R6  51R  [R0603]  37.21 36.41 0 top
R9  2.4K  [R0603]  40.39 33.62 0 top
R11  10K  [R0603]  42.22 43.14 0 top
R12  10K  [R0603]  48.69 43.02 0 top
R13  0.4  [R0603]  43.99 34.25 0 top
R15  10K  [R0603]  22.73 29.04 180 bottom
R16  10K  [R0603]  32.31 41.39 180 bottom
R17  4.7K  [R0603]  37.16 41.31 180 bottom
R18  4.7K  [R0603]  40.21 41.31 180 bottom
R20  330K  [R0603]  -7.47 46.83 180 bottom
R21  10K  [R0603]  -17.37 44.54 180 bottom
R22  10mΩ  [RES-SMD_L6.4-W3.2-1]  32.5 20 0 bottom
R23  330K  [R0603]  -12.8 35.39 180 bottom
R24  10K  [R0603]  -16.61 38.44 180 bottom
R26  10K  [R0603]  38.37 27.85 180 bottom
R27  10K  [R0603]  38.37 25.79 180 bottom
R28  10K  [R0603]  39.13 23.73 180 bottom
R29  100K  [R0603]  52.58 19.27 0 bottom
R30  30K  [R0603]  49.4 19.27 0 bottom
R31  SDNT2012X103F3950FTF  [R0805]  48.01 2.88 180 bottom
R32  10K  [R0603]  49.08 6.54 180 bottom
R33  300R  [R0603]  29.99 25.02 0 top
R34  10K  [R0603]  28.19 31.58 0 top
R35  5.1K  [R0603]  28.48 39.59 0 top
R36  5.1K  [R0603]  36.96 39.2 0 top
R37  100K  [R0603]  28.07 7.2 180 top
R38  30K  [R0603]  29.08 4.41 0 top
SCREW1  -  [M2螺丝]  5 45 0 top
SCREW2  -  [M2螺丝]  5 23 0 top
SCREW3  -  [M2螺丝]  60 45 0 top
SCREW4  -  [M2螺丝]  5 5 0 top
SCREW5  -  [M2螺丝]  26 45 0 top
SCREW7  -  [M2螺丝]  26 23 0 top
SCREW8  -  [M2螺丝]  60 5 0 top
SCREW9  -  [M3螺丝]  33 37 0 top
SCREW10  -  [M3螺丝]  53 37 0 top
SCREW11  -  [M3螺丝]  53 11 0 top
SCREW12  -  [M3螺丝]  33 11 0 top
SW2  SS-12D10L5  [SW-TH_SS-12D10L5]  61.59 35.52 270 top
SW4  TS-1088-AR02016  [SW-SMD_L3.9-W3.0-P4.45]  49.28 33.67 180 bottom
SW5  TS-1088-AR02016  [SW-SMD_L3.9-W3.0-P4.45]  49.28 29.93 180 bottom
SW6  TS-1088-AR02016  [SW-SMD_L3.9-W3.0-P4.45]  50.04 26.19 180 bottom
SW7  TS-1088-AR02016  [SW-SMD_L3.9-W3.0-P4.45]  35.31 23.84 0 top
U1  STC8G2K64S4-36I-LQFP48  [LQFP-48_L7.0-W7.0-P0.50-LS9.0-BL]  14.86 32.6 0 top
U2  CH340E  [MSOP-10_L3.0-W3.0-P0.50-LS5.0-BL]  22.35 38.44 270 top
U6  AMS1117-3.3  [SOT-223-4_L6.5-W3.5-P2.30-LS7.0-BR]  42.67 28.92 0 top
U9  22uF  [CAP-SMD_L2.0-W1.3-FD]  34.67 31.2 180 top
U10  TP4056  [ESOP-8_L4.9-W3.9-P1.27-LS6.0-BL-EP]  43.13 38.44 270 top
U12  W25Q64JVSSIQ  [SOIC-8_L5.3-W5.3-P1.27-LS8.0-BL]  14.51 35.89 180 bottom
U13  MPU-6050  [QFN-24_L4.0-W4.0-P0.50-BL-EP2.7]  32.54 30.21 180 bottom
U14  WAFER-GH1.25-4PWB  [CONN-SMD_4P-P1.25_XUNPU_WAFER-GH1.25-4PWB]  36.96 3.77 180 bottom
U16  LMV321IDBVR  [SOT-23-5_L2.9-W1.6-P0.95-LS2.8-BR]  -6.71 41.49 180 bottom
U17  WAFER-GH1.25-4PWB  [CONN-SMD_4P-P1.25_XUNPU_WAFER-GH1.25-4PWB]  36.96 3.39 0 top
U18  TYPEC-955-ARP24  [TYPE-C-SMD_TYPEC-955-ARP24]  3.81 15 270 top
USB2  USB-TYPE-C-018  [USB-C_SMD-TYPE-C-31-M-12]  33 45 180 top
USB3  TYPEC-1103-BRP24  [USB-C-SMD_TYPEC-1103-BRP24]  58.55 15 270 bottom
X1  25MHz  [CRYSTAL-SMD_2P-L5.0-W3.2]  14.37 40.28 0 top

## Footprints (pads in the part's own frame, mm; a bottom-side part is the same pattern mirrored in y, then rotated)
C0603
  rect 0.8x0.9 smd: 1(-0.7,0) 2(0.7,0)
CAP-SMD_L2.0-W1.3-FD
  rect 1.1x1.3 smd: 1(-1,0) 2(1,0)
CONN-SMD_4P-P1.25_XUNPU_WAFER-GH1.25-4PWB
  rect 0.6x1.7 smd: 1(-1.875,1.575) 2(-0.625,1.575) 3(0.625,1.575) 4(1.875,1.575)
  rect 1x2.8 smd: 5(3.725,-1.575) 6(-3.725,-1.575)
CONN-TH_2P-P2.50_HX25003-2A
  rect 1.8x1.8 hole 1.1: 1(-1.25,0)
  round 1.8 hole 1.1: 2(1.25,0)
CRYSTAL-SMD_2P-L5.0-W3.2
  rect 1.9x2.4 smd: 1(-1.95,0) 2(1.95,0)
ESOP-8_L4.9-W3.9-P1.27-LS6.0-BL-EP
  rect 0.6x1.2 smd: 1(-1.905,-2.909) 2(-0.635,-2.909) 3(0.635,-2.909) 4(1.905,-2.909) 5(1.905,2.909) 6(0.635,2.909) 7(-0.635,2.909) 8(-1.905,2.909)
  rect 3.3x2.4 smd: 9(0,0)
HDR-TH_2P-P2.54-V-M
  rect 2x2 hole 1.2: 1(-1.27,0)
  round 2 hole 1.2: 2(1.27,0)
HDR-TH_3P-P2.54-V-M
  rect 1.7x1.7 hole 1.1: 1(-2.54,0)
  round 1.7 hole 1.1: 2(0,0) 3(2.54,0)
HDR-TH_4P-P2.54-V-M
  rect 1.7x1.7 hole 1.1: 1(-3.81,0)
  round 1.7 hole 1.1: 2(-1.27,0) 3(1.27,0) 4(3.81,0)
HDR-TH_5P-P2.54-V-F
  rect 1.575x1.575 hole 1.02: 1(-5.08,0)
  round 1.575 hole 1.02: 2(-2.54,0) 3(0,0) 4(2.54,0) 5(5.08,0)
HDR-TH_8P-P2.54-V-M-R2-C4-S2.54
  rect 1.7x1.7 hole 1.1: 1(-3.81,-1.27)
  round 1.7 hole 1.1: 2(-3.81,1.27) 3(-1.27,-1.27) 4(-1.27,1.27) 5(1.27,-1.27) 6(1.27,1.27) 7(3.81,-1.27) 8(3.81,1.27)
LED_0603
  rect 0.8x0.8 smd: 1(-0.851,-0.01) 2(0.75,-0.005)
LED_TH-3mm
  round 1.524 hole 0.914: 1(-1.27,0) 2(1.27,0)
LQFP-48_L7.0-W7.0-P0.50-LS9.0-BL
  oval 0.27x1.5 smd: 1(-2.75,-4.25) 2(-2.25,-4.25) 3(-1.75,-4.25) 4(-1.25,-4.25) 5(-0.75,-4.25) 6(-0.25,-4.25) 7(0.25,-4.25) 8(0.75,-4.25) 9(1.25,-4.25) 10(1.75,-4.25) 11(2.25,-4.25) 12(2.75,-4.25) 25(2.75,4.25) 26(2.25,4.25) 27(1.75,4.25) 28(1.25,4.25) 29(0.75,4.25) 30(0.25,4.25) 31(-0.25,4.25) 32(-0.75,4.25) 33(-1.25,4.25) 34(-1.75,4.25) 35(-2.25,4.25) 36(-2.75,4.25)
  oval 1.5x0.27 smd: 13(4.25,-2.75) 14(4.25,-2.25) 15(4.25,-1.75) 16(4.25,-1.25) 17(4.25,-0.75) 18(4.25,-0.25) 19(4.25,0.25) 20(4.25,0.75) 21(4.25,1.25) 22(4.25,1.75) 23(4.25,2.25) 24(4.25,2.75) 37(-4.25,2.75) 38(-4.25,2.25) 39(-4.25,1.75) 40(-4.25,1.25) 41(-4.25,0.75) 42(-4.25,0.25) 43(-4.25,-0.25) 44(-4.25,-0.75) 45(-4.25,-1.25) 46(-4.25,-1.75) 47(-4.25,-2.25) 48(-4.25,-2.75)
M2螺丝
  round 2 hole 2: 1(0,0)
M3螺丝
  round 3.2 hole 3.2: 1(-0.064,0.064)
MSOP-10_L3.0-W3.0-P0.50-LS5.0-BL
  oval 0.28x1.62 smd: 1(-1,-2.11) 2(-0.5,-2.11) 3(0,-2.11) 4(0.5,-2.11) 5(1,-2.11) 6(1,2.11) 7(0.5,2.11) 8(0,2.11) 9(-0.5,2.11) 10(-1,2.11)
QFN-24_L4.0-W4.0-P0.50-BL-EP2.7
  oval 0.28x0.8 smd: 1(-1.25,-2) 2(-0.75,-2) 3(-0.25,-2) 4(0.25,-2) 5(0.75,-2) 6(1.25,-2) 13(1.25,2) 14(0.75,2) 15(0.25,2) 16(-0.25,2) 17(-0.75,2) 18(-1.242,2)
  oval 0.8x0.28 smd: 7(2,-1.25) 8(2,-0.75) 9(2,-0.25) 10(2,0.25) 11(2,0.75) 12(2,1.25) 19(-2,1.25) 20(-2,0.75) 21(-2,0.25) 22(-2,-0.25) 23(-2,-0.75) 24(-2,-1.25)
  rect 2.7x2.7 smd: 25(0.013,0)
R0603
  rect 0.806x0.864 smd: 1(-0.753,0) 2(0.753,0)
R0805
  rect 1.133x1.377 smd: 1(-1,0) 2(1,0)
RES-SMD_L6.4-W3.2-1
  rect 2.5x3.4 smd: 1(-3.1,0) 2(3.1,0)
SOD-523_L1.2-W0.8-LS1.6-RD
  rect 0.93x0.36 smd: 1(-0.635,0) 2(0.635,0)
SOIC-8_L5.3-W5.3-P1.27-LS8.0-BL
  oval 0.63x2.25 smd: 1(-1.905,-3.53) 2(-0.635,-3.53) 3(0.635,-3.53) 4(1.905,-3.53) 5(1.905,3.53) 6(0.635,3.53) 7(-0.635,3.53) 8(-1.905,3.53)
SOT-23-5_L2.9-W1.6-P0.95-LS2.8-BR
  rect 1x0.6 smd: 1(1.1,-0.95) 2(1.1,0) 3(1.1,0.95) 4(-1.1,0.95) 5(-1.1,-0.95)
SOT-223-4_L6.5-W3.5-P2.30-LS7.0-BR
  rect 2.47x0.98 smd: 1(2.835,-2.3) 2(2.835,0) 3(2.835,2.3)
  rect 2.47x3.6 smd: 4(-2.835,0)
SW-SMD_L3.9-W3.0-P4.45
  rect 1.23x1.36 smd: 1(-2.185,0) 2(2.185,0)
SW-TH_SS-12D10L5
  oval 2x3 hole 1.3x2: 1(-4.7,0) 2(0,0) 3(4.7,0)
TYPE-C-SMD_TYPEC-955-ARP24
  rect 0.6x1.55 smd far side: 25(-3.42,0.188)
  rect 0.6x1.55 smd: 25(3.42,0.188)
  rect 0.25x1.3 smd: A1(2.75,-0.188) A2(2.25,-0.188) A3(1.75,-0.188) A4(1.25,-0.188) A5(0.75,-0.188) A6(0.25,-0.188) A7(-0.25,-0.188) A8(-0.75,-0.188) A9(-1.25,-0.188) A10(-1.75,-0.188) A11(-2.25,-0.188) A12(-2.75,-0.188)
  rect 0.25x1.3 smd far side: B1(-2.75,-0.188) B2(-2.25,-0.188) B3(-1.75,-0.188) B4(-1.25,-0.188) B5(-0.75,-0.188) B6(-0.25,-0.188) B7(0.25,-0.188) B8(0.75,-0.188) B9(1.25,-0.188) B10(1.75,-0.188) B11(2.25,-0.188) B12(2.75,-0.188)
USB-C-SMD_TYPEC-1103-BRP24
  rect 0.7x1.7 smd: 25(-4.32,0.275) 25(4.32,0.275)
  rect 0.7x1.7 smd far side: 26(-4.32,0.275) 26(4.32,0.275)
  rect 0.3x1.7 smd: A1(-2.75,-0.275) A2(-2.25,-0.275) A3(-1.75,-0.275) A4(-1.25,-0.275) A5(-0.75,-0.275) A6(-0.25,-0.275) A7(0.25,-0.275) A8(0.75,-0.275) A9(1.25,-0.275) A10(1.75,-0.275) A11(2.25,-0.275) A12(2.75,-0.275)
  rect 0.3x1.7 smd far side: B1(2.75,-0.275) B2(2.25,-0.275) B3(1.75,-0.275) B4(1.25,-0.275) B5(0.75,-0.275) B6(0.25,-0.275) B7(-0.25,-0.275) B8(-0.75,-0.275) B9(-1.25,-0.275) B10(-1.75,-0.275) B11(-2.25,-0.275) B12(-2.75,-0.275)
USB-C_SMD-TYPE-C-31-M-12
  oval 1.2x2 hole 0.8x1.6: 0(-4.325,1.706) 1(4.325,1.706)
  oval 1.2x1.8 hole 0.8x1.4: 2(4.325,-2.474) 3(-4.325,-2.474)
  rect 0.3x1.3 smd: A1(-3.35,2.474) A4(-2.55,2.474) A5(-1.25,2.474) A6(-0.25,2.474) A7(0.25,2.474) A8(1.25,2.474) A9(2.55,2.474) A12(3.35,2.474) B1(3.05,2.474) B4(2.25,2.474) B5(1.75,2.474) B6(0.75,2.474) B7(-0.75,2.474) B8(-1.75,2.474) B9(-2.25,2.474) B12(-3.05,2.474)

## Nets
As in the schematic.

Pads without a net: H1 4 6; SCREW1 1; SCREW2 1; SCREW3 1; SCREW4 1; SCREW5 1; SCREW7 1; SCREW8 1; SCREW9 1; SCREW10 1; SCREW11 1; SCREW12 1; SW2 3; U2 4 5; U13 2 3 4 5 6 7 14 15 16 17 19 21 22 25; U14 2 5 6; U17 2 5 6; USB2 A8 B8

## Via types
v1: diameter 0.61, hole 0.305, Top Layer to Bottom Layer, 5 vias

## Routing (per net, layer and track width the routed paths; a pad name or vN(x,y) marks a point on that pad's centre or on a via; arc(x,y) is an arc through that point)
CC1: length 57.4
  Top Layer w0.127: U18.A5 4.2,14.25 5.13,13.33 53.11,13.33 54.1,14.31 v1(54.1,15.7)
  Bottom Layer w0.127: USB3.A5 58.78,15.7 v1(54.1,15.7)
CC2: length 51.7
  Bottom Layer w0.127: U18.B5 3.75,15.75 3.91,15.91 4.49,15.91 4.81,16.23 v1(55.12,16.23)
DN:
  vias: v1(55.51,14.37)
DP:
  vias: v1(55.51,15.13)
RX1+: length 55.2
  Top Layer w0.127: U18.A11 USB3.B11
RX1-: length 55.2
  Top Layer w0.127: U18.A10 USB3.B10
RX2+: length 55.3
  Bottom Layer w0.127: U18.B11 32.02,12.75 32.18,12.9 53.7,12.9 53.85,12.75 USB3.A11
RX2-: length 55.2
  Bottom Layer w0.127: U18.B10 USB3.A10
SBU1: length 56.1
  Top Layer w0.127: U18.A8 3.75,15.75 3.78,15.72 4.36,15.72 4.37,15.71 50.84,15.71 v1(52.71,13.84)
  Bottom Layer w0.127: v1(52.71,13.84) 56.81,13.84 57.09,14.12 58.82,14.12
